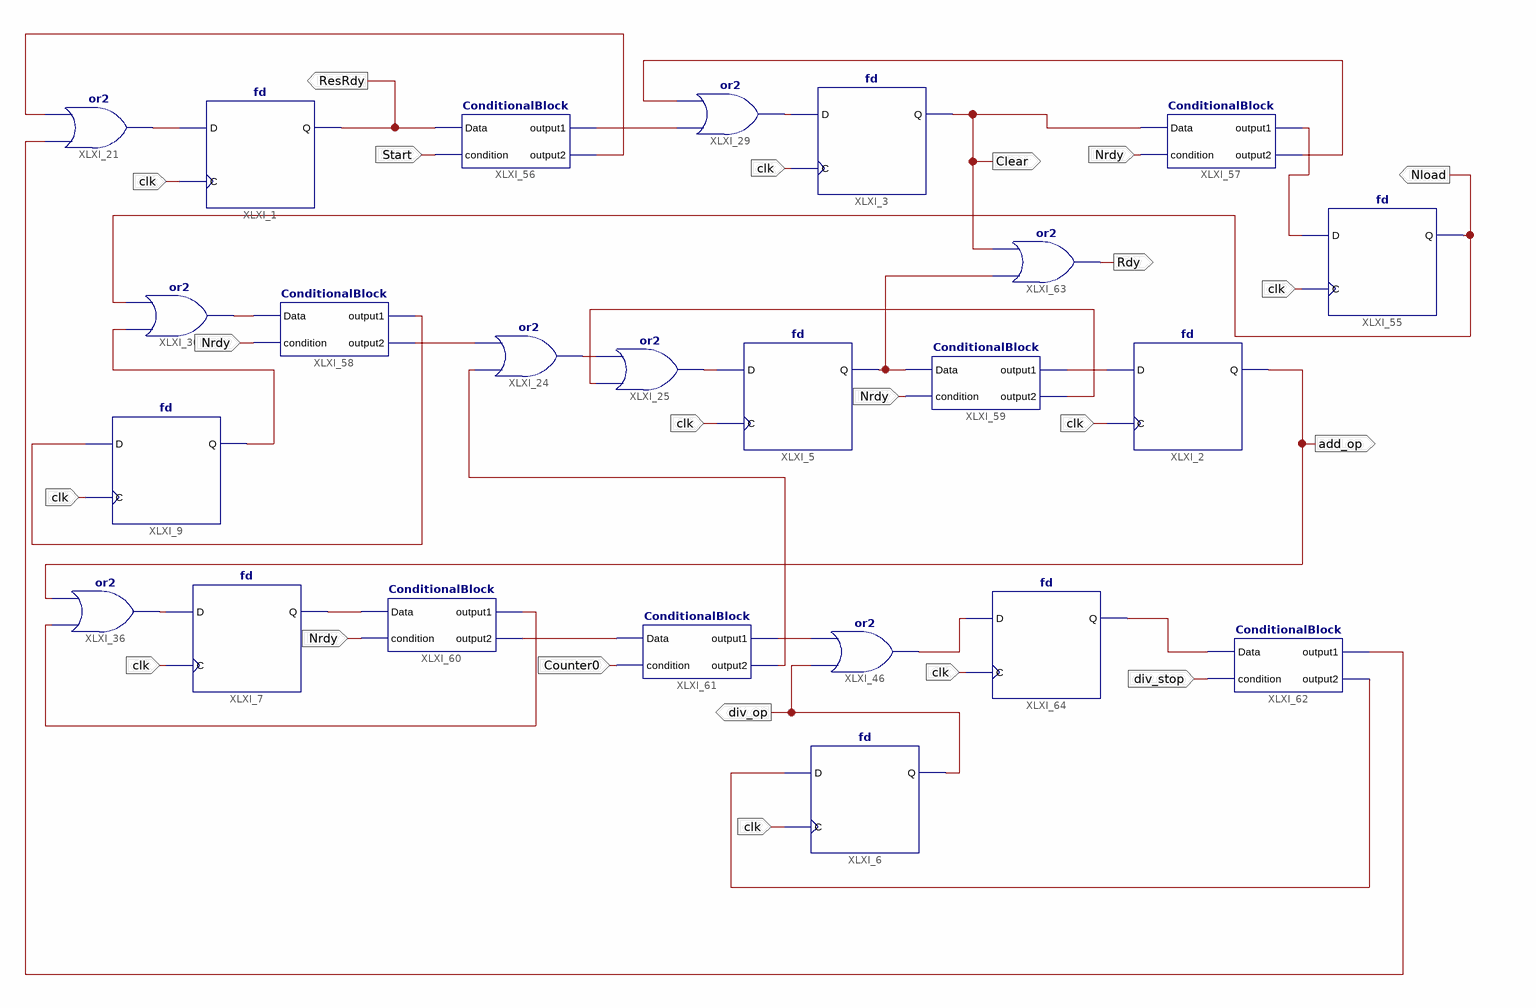
[diagram p0: schematic sheet 1]
// Xilinx ISE schematic Sequencer.sch (spartan3a) as structural Verilog: 24 symbols, 11 ports
module Sequencer (
  input  Start,
  input  clk,
  input  Nrdy,
  input  Counter0,
  input  div_stop,
  output add_op,
  output div_op,
  output ResRdy,
  output Rdy,
  output Clear,
  output Nload
);

  wire XLXN_23, XLXN_30, XLXN_31, XLXN_55, XLXN_56, XLXN_61, XLXN_62, XLXN_63, XLXN_111, XLXN_119, XLXN_144,
       XLXN_156, XLXN_182, XLXN_187, XLXN_197, XLXN_199, XLXN_203, XLXN_208, XLXN_209, XLXN_210, XLXN_217,
       XLXN_222, XLXN_223, XLXN_230, XLXN_231;

  fd XLXI_2 (.C(clk), .D(XLXN_119), .Q(add_op));
  fd XLXI_5 (.C(clk), .D(XLXN_63), .Q(XLXN_203));
  fd XLXI_7 (.C(clk), .D(XLXN_217), .Q(XLXN_230));
  fd XLXI_9 (.C(clk), .D(XLXN_56), .Q(XLXN_55));
  fd #(.INIT("1")) XLXI_1 (.C(clk), .D(XLXN_30), .Q(ResRdy));
  or XLXI_21 (XLXN_30, XLXN_182, XLXN_31);
  or XLXI_24 (XLXN_62, XLXN_144, XLXN_61);
  or XLXI_25 (XLXN_63, XLXN_111, XLXN_62);
  or XLXI_29 (XLXN_197, XLXN_23, XLXN_199);
  or XLXI_30 (XLXN_208, XLXN_55, Nload);
  or XLXI_36 (XLXN_217, XLXN_231, add_op);
  or XLXI_46 (XLXN_209, div_op, XLXN_223);
  fd XLXI_6 (.C(clk), .D(XLXN_156), .Q(div_op));
  ConditionalBlock XLXI_56 (.condition(Start), .Data(ResRdy), .output1(XLXN_23), .output2(XLXN_31));
  ConditionalBlock XLXI_57 (.condition(Nrdy), .Data(Clear), .output1(XLXN_187), .output2(XLXN_199));
  ConditionalBlock XLXI_58 (.condition(Nrdy), .Data(XLXN_208), .output1(XLXN_56), .output2(XLXN_61));
  ConditionalBlock XLXI_59 (.condition(Nrdy), .Data(XLXN_203), .output1(XLXN_119), .output2(XLXN_111));
  ConditionalBlock XLXI_61 (.condition(Counter0), .Data(XLXN_222), .output1(XLXN_223), .output2(XLXN_144));
  ConditionalBlock XLXI_62 (.condition(div_stop), .Data(XLXN_210), .output1(XLXN_182), .output2(XLXN_156));
  fd XLXI_3 (.C(clk), .D(XLXN_197), .Q(Clear));
  or XLXI_63 (Rdy, XLXN_203, Clear);
  fd XLXI_55 (.C(clk), .D(XLXN_187), .Q(Nload));
  fd XLXI_64 (.C(clk), .D(XLXN_209), .Q(XLXN_210));
  ConditionalBlock XLXI_60 (.condition(Nrdy), .Data(XLXN_230), .output1(XLXN_231), .output2(XLXN_222));
endmodule
